# EAGLE design Day0_Samuel Siahaan_13214088 (EAGLE 7.6.0)
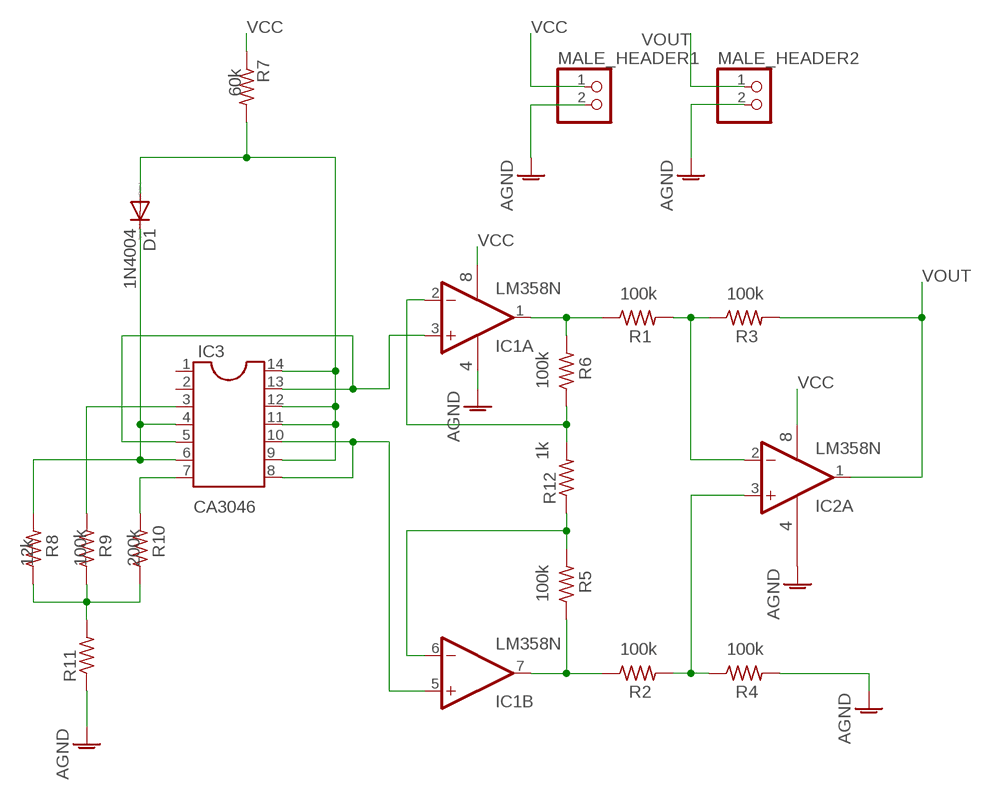
[diagram p0: schematic, sheet 1]

## Parts
D1  1N4004  [DO41-10]
IC1  LM358N  [DIL08]
IC2  LM358N  [DIL08]
IC3  DIL14  [DIL14]
MALE_HEADER1  PINHD-1X2  [1X02]
MALE_HEADER2  PINHD-1X2  [1X02]
R1  R-US_0204/7  [0204/7]
R2  R-US_0204/7  [0204/7]
R3  R-US_0204/7  [0204/7]
R4  R-US_0204/7  [0204/7]
R5  R-US_0204/7  [0204/7]
R6  R-US_0204/7  [0204/7]
R7  R-US_0204/7  [0204/7]
R8  R-US_0204/7  [0204/7]
R9  R-US_0204/7  [0204/7]
R10  R-US_0204/7  [0204/7]
R11  R-US_0204/7  [0204/7]
R12  R-US_0204/7  [0204/7]

## Nets
AGND: MALE_HEADER1.2 MALE_HEADER2.2 R4.2 R11.1
N$1: R8.1 R9.1 R10.1 R11.2
N$2: IC3.7 R10.2
N$3: IC3.3 R9.2
N$4: D1.C IC3.4 IC3.6 R8.2
N$5: D1.A IC3.9 IC3.11 IC3.12 IC3.14 R7.2
N$6: IC1.6(B:-IN) R5.2 R12.1
N$7: IC1.7(B:OUT) R2.1 R5.1
N$8: IC1.5(B:+IN) IC3.8 IC3.10
N$9: IC1.3(A:+IN) IC3.5 IC3.13
N$10: IC2.3(A:+IN) R2.2 R4.1
N$11: IC2.2(A:-IN) R1.2 R3.1
N$12: IC1.2(A:-IN) R6.1 R12.2
N$13: IC1.1(A:OUT) R1.1 R6.2
VCC: MALE_HEADER1.1 R7.1
VOUT: IC2.1(A:OUT) MALE_HEADER2.1 R3.2
Unconnected: IC2.5(B:+IN) IC2.6(B:-IN) IC2.7(B:OUT) IC3.1 IC3.2

## Power pins joined to a net without a drawn wire
V+: IC1.8(P:V+) IC2.8(P:V+)
V-: IC1.4(P:V-) IC2.4(P:V-)

## Library data of the parts
D1 = diode:1N4004: DIODE general purpose rectifier, 1 A
IC1 IC2 = linear:LM358: OP AMP also LM158; LM258; LM2904 Source: http://cache.national.com/ds/LM/LM158.pdf; PIN4: 4; PIN8: 8
IC3 = ic-package:DIL14: Dual In Line / Socket; NAMA: CA3046
MALE_HEADER1 MALE_HEADER2 = pinhead:PINHD-1X2: PIN HEADER
R1-R6 R9 = rcl:R-US_: RESISTOR, American symbol; R: 100k
R7 = rcl:R-US_: RESISTOR, American symbol; R: 60k
R8 = rcl:R-US_: RESISTOR, American symbol; R: 12k
R10 = rcl:R-US_: RESISTOR, American symbol; R: 200k
R11 = rcl:R-US_: RESISTOR, American symbol
R12 = rcl:R-US_: RESISTOR, American symbol; R: 1k

## Board
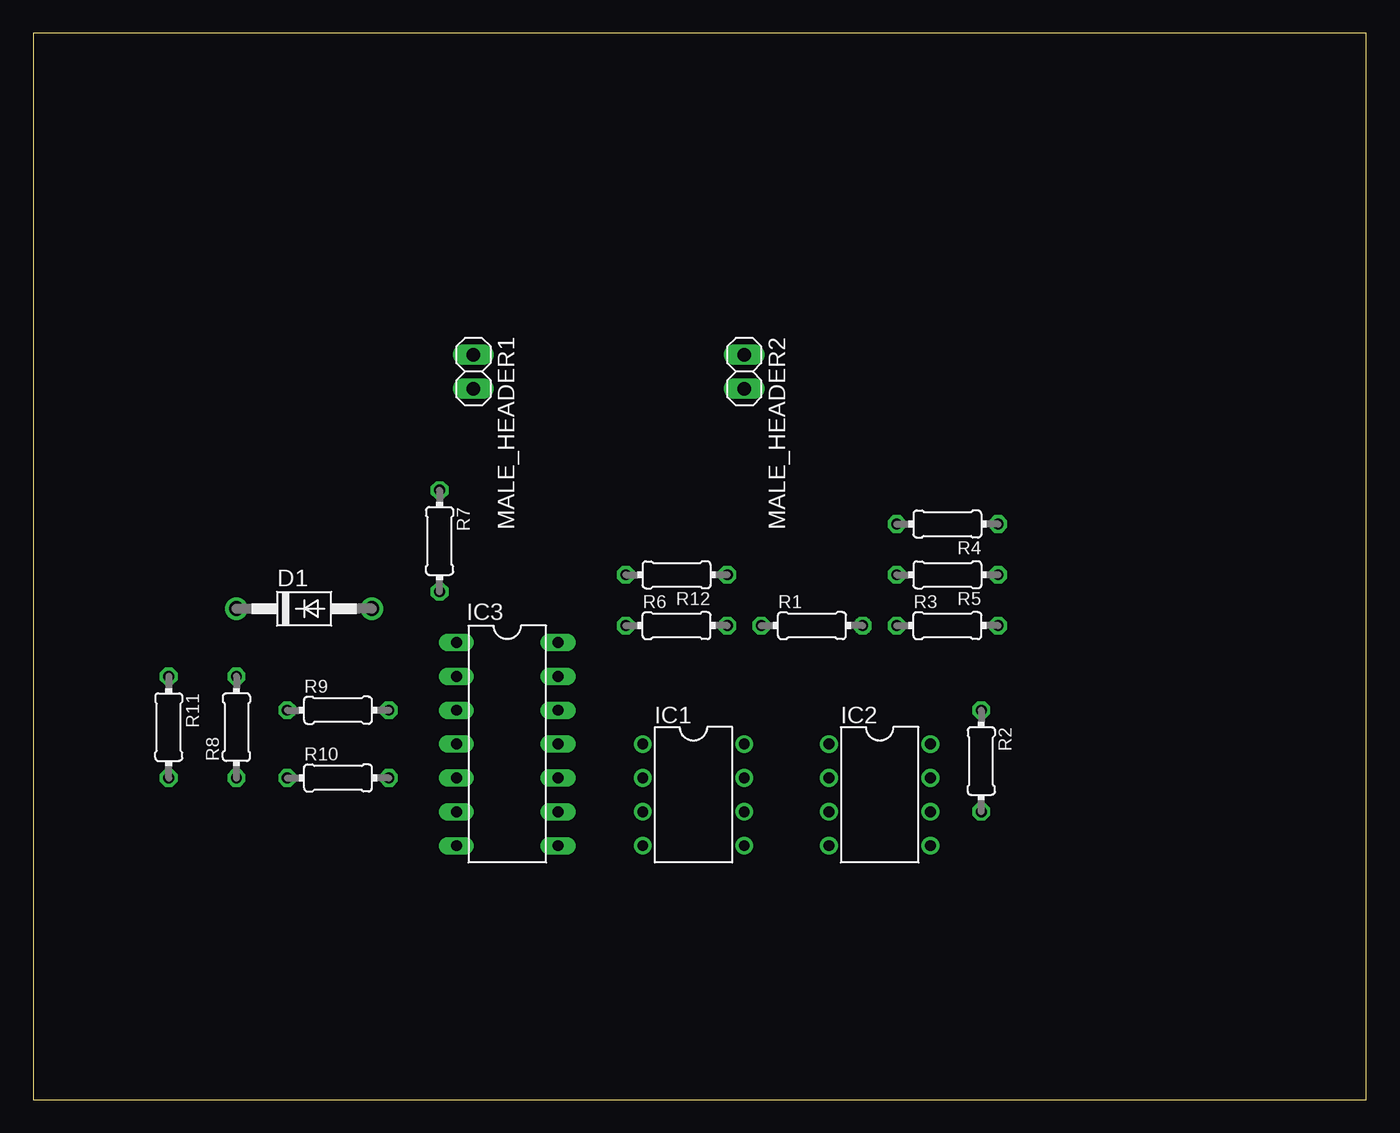
[diagram p1: board, top side]
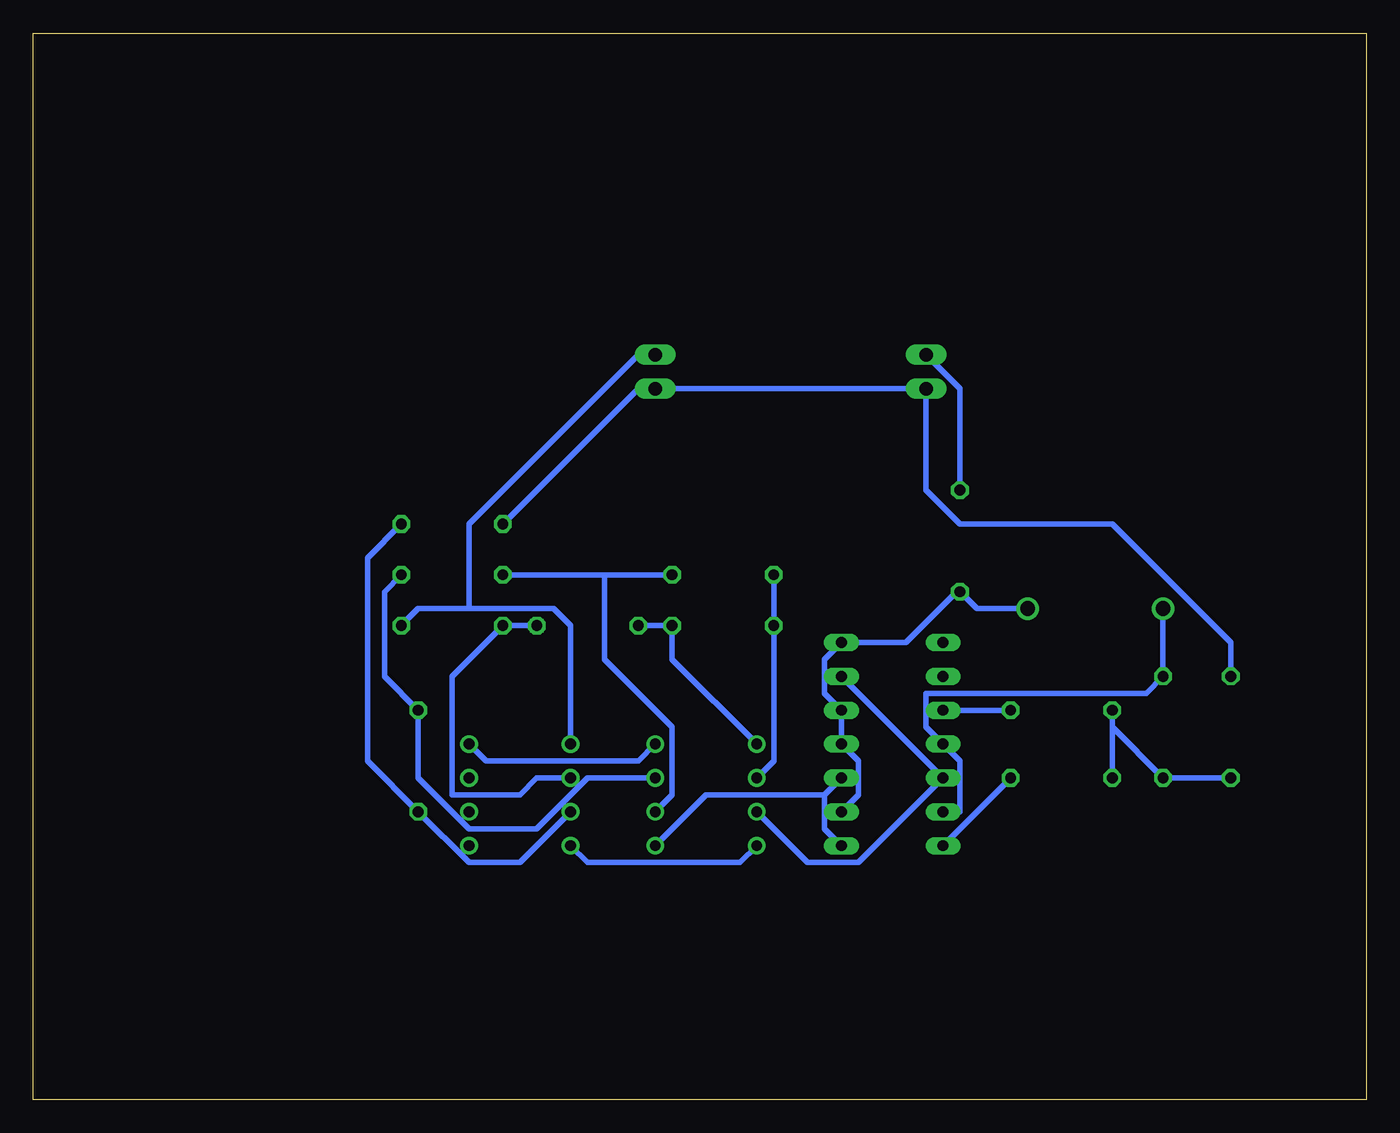
[diagram p2: board, bottom side, seen from below]

Size 100 x 80 mm. Coordinates in mm from the lower left corner, seen from the top.
Outline: 0,0 100,0 100,80 0,80 0,0
Copper layers (1*16): Top 0.035mm / dielectric 1.5mm / Bottom 0.035mm
Design rules "default": minimum track width 10mil, minimum drill 24mil, track to track 8mil, track to pad 8mil, pad to pad 8mil, via to via 8mil, smd to smd 8mil, copper to edge 40mil, drill to drill 8mil, minimum pad ring 10mil, minimum via ring 8mil, stop-mask expansion 4mil, vias tented up to drill 0mil, thermal gap 10mil

### Footprints (pad centres in the part's own frame; a part is rotated, then mirrored left to right if it is on the bottom)
DO41-10 = drill 1.118: A 5.08,0; C -5.08,0
DIL08 = drill 0.813 pad 1.27: 1 -3.81,-3.81; 2 -1.27,-3.81; 3 1.27,-3.81; 4 3.81,-3.81; 5 3.81,3.81; 6 1.27,3.81; 7 -1.27,3.81; 8 -3.81,3.81
DIL14 = drill 0.813 long: 1 -7.62,-3.81; 2 -5.08,-3.81; 3 -2.54,-3.81; 4 0,-3.81; 5 2.54,-3.81; 6 5.08,-3.81; 7 7.62,-3.81; 8 7.62,3.81; 9 5.08,3.81; 10 2.54,3.81; 11 0,3.81; 12 -2.54,3.81; 13 -5.08,3.81; 14 -7.62,3.81
1X02 = drill 1.016 long: 1 -1.27,0; 2 1.27,0
0204/7 = drill 0.813 octagon: 1 -3.81,0; 2 3.81,0

### Placement (x,y rotation side)
D1  20.32,36.83 0 top
IC1  49.53,22.86 270 top
IC2  63.5,22.86 270 top
IC3  35.56,26.67 270 top
MALE_HEADER1  33.02,54.61 270 top
MALE_HEADER2  53.34,54.61 270 top
R1  58.42,35.56 0 top
R2  71.12,25.4 270 top
R3  68.58,35.56 0 top
R4  68.58,43.18 180 top
R5  68.58,39.37 180 top
R6  48.26,35.56 0 top
R7  30.48,41.91 270 top
R8  15.24,27.94 90 top
R9  22.86,29.21 0 top
R10  22.86,24.13 0 top
R11  10.16,27.94 270 top
R12  48.26,39.37 180 top

### Tracks (layer width: path | path; a pad name or v marks a point on that pad's centre or on a via)
AGND
  Bottom 0.406: R11.1 10.16,34.29 19.05,43.18 30.48,43.18 33.02,45.72 MALE_HEADER1.2 MALE_HEADER2.2 54.61,53.34 R4.2
N$1
  Bottom 0.406: R11.2 R8.1 19.05,27.94 | 19.05,27.94 R9.1 | R10.1 19.05,27.94
N$2
  Bottom 0.406: IC3.7 R10.2
N$3
  Bottom 0.406: R9.2 IC3.3
N$4
  Bottom 0.406: D1.C R8.2 16.51,30.48 33.02,30.48 33.02,27.94 IC3.4 30.48,25.4 30.48,21.59 IC3.6
N$5
  Bottom 0.406: R7.2 31.04,37.76 | D1.A 29.21,36.83 30.14,37.76 31.04,37.76 | 31.04,37.76 34.51,34.29 IC3.14 40.64,33.02 40.64,30.48 IC3.12 IC3.11 38.1,25.4 38.1,22.86 IC3.9
N$6
  Bottom 0.406: R5.2 57.15,39.37 | 57.15,39.37 R12.1 | IC1.6 52.07,22.86 52.07,27.94 57.15,33.02 57.15,39.37
N$7
  Bottom 0.406: R5.1 73.66,38.1 73.66,31.75 R2.1 71.12,24.13 67.31,20.32 62.23,20.32 58.42,24.13 IC1.7
N$8
  Bottom 0.406: IC3.10 40.64,22.86 | 40.64,22.86 40.64,20.32 IC3.8 | IC1.5 49.53,22.86 40.64,22.86
N$9
  Bottom 0.406: IC1.3 41.91,17.78 38.1,17.78 IC3.5 IC3.13
N$10
  Bottom 0.406: R4.1 74.93,40.64 74.93,25.4 R2.2 67.31,17.78 63.5,17.78 IC2.3
N$11  (via drill 0.6)
  Bottom 0.406: R1.2 R3.1 68.58,31.75 68.58,22.86 63.5,22.86 62.23,24.13 IC2.2
  other vias: 62.23,35.56
N$12
  Bottom 0.406: R12.2 R6.1 44.45,25.4 IC1.2
N$13
  Bottom 0.406: IC1.1 52.07,33.02 R6.2 R1.1
V+
  Bottom 0.406: IC1.8 54.61,25.4 66.04,25.4 IC2.8
V-
  Bottom 0.406: IC1.4 46.99,17.78 58.42,17.78 IC2.4
VCC
  Bottom 0.406: R7.1 30.48,53.34 MALE_HEADER1.1
VOUT
  Bottom 0.406: MALE_HEADER2.1 54.61,55.88 67.31,43.18 67.31,36.83 | 67.31,36.83 71.12,36.83 R3.2 | IC2.1 59.69,35.56 60.96,36.83 67.31,36.83